# EAGLE design 16x2LCDShieldv2 (EAGLE 5.10)
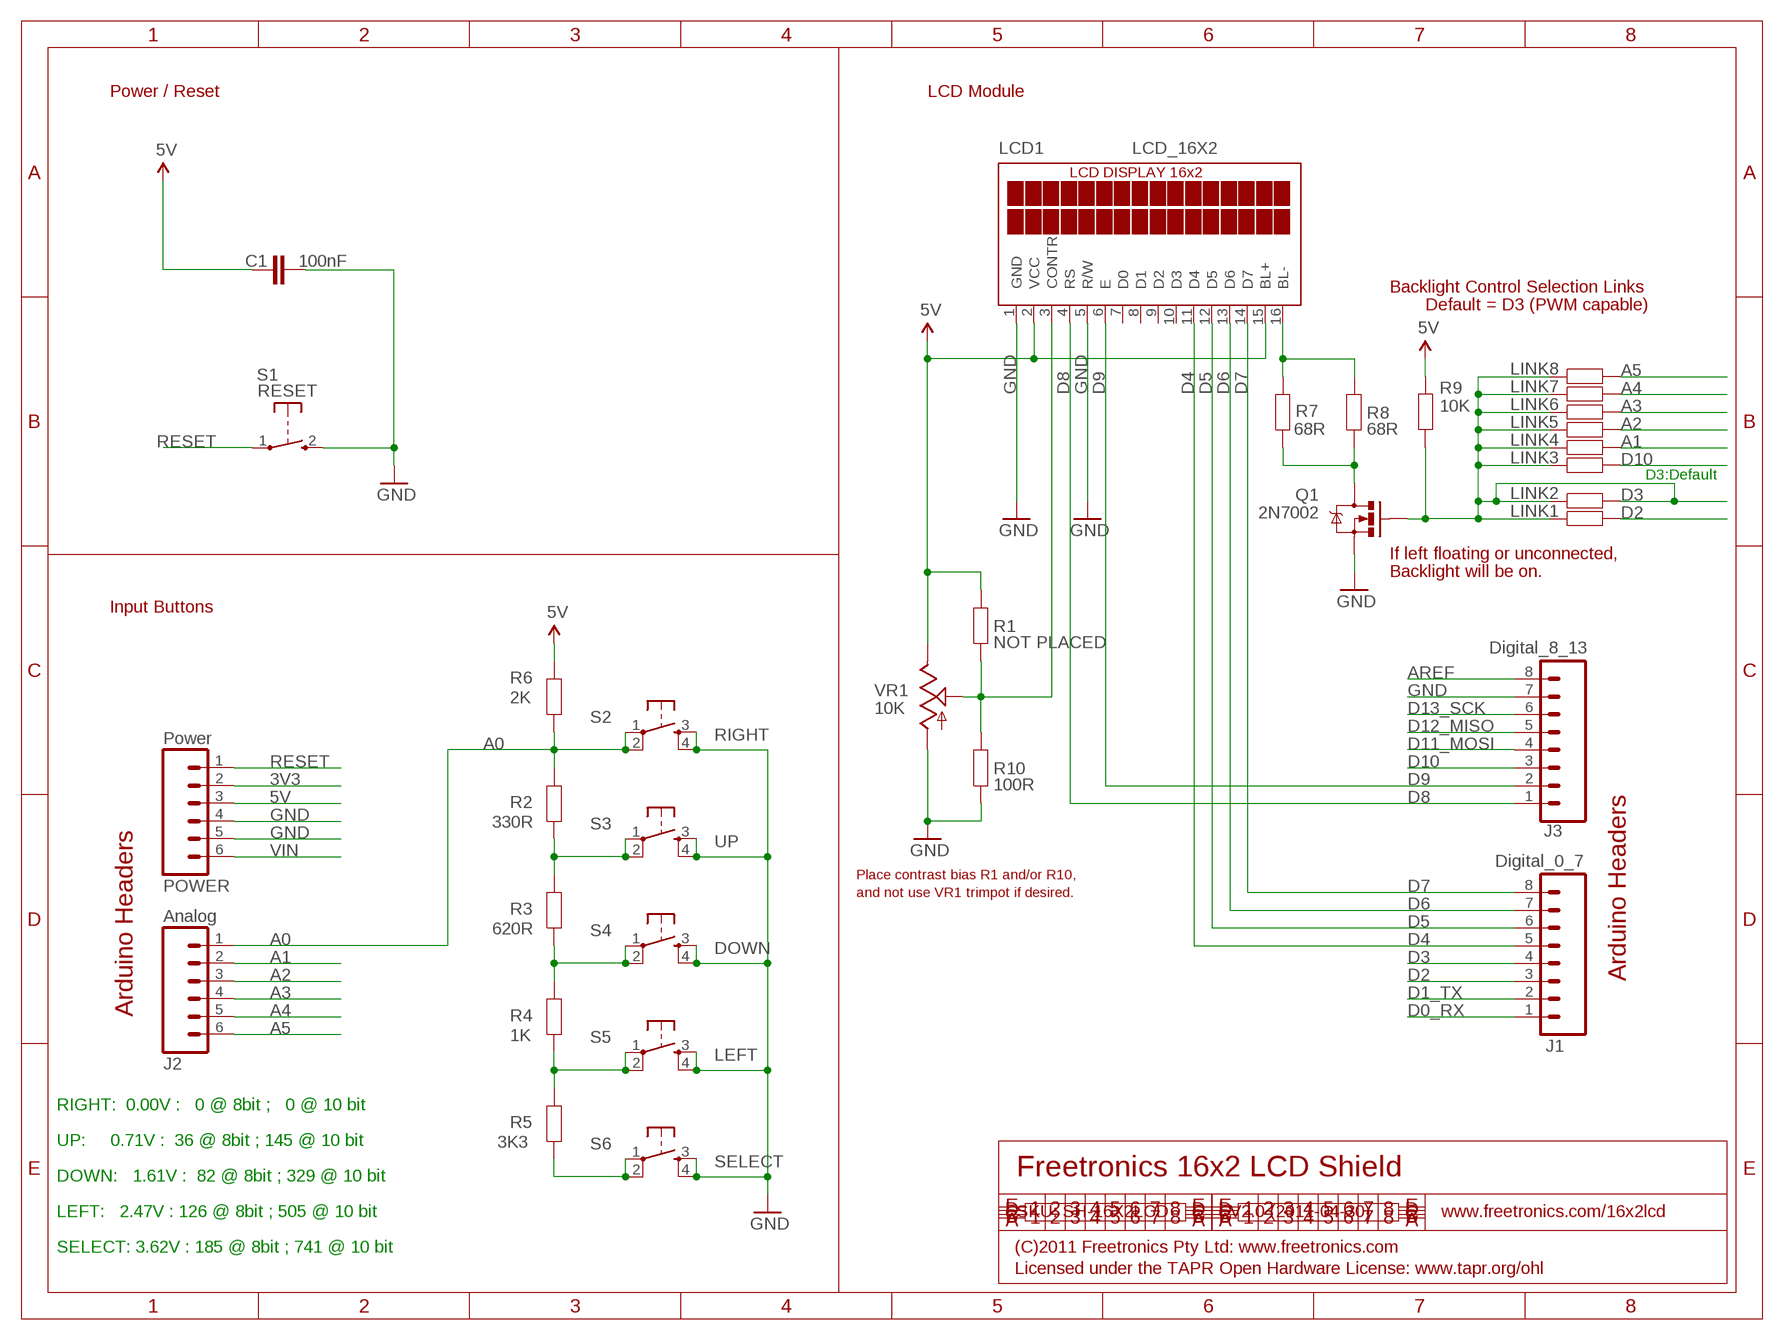
[diagram p0: schematic, sheet 1]

## Parts
C1  100nF  CAP0603  [0603]
J1  Digital_0_7  M08  [1X08]
J2  Analog  M06SIP  [1X06]
J3  Digital_8_13  M08  [1X08]
LCD1  LCD_16X2  LCD_16X2_NEWLCD_16X2  [LCD_16X2_REAR]
LINK1  RESISTOR0603  [0603]
LINK2  RESISTOR0603  [0603]
LINK3  RESISTOR0603  [0603]
LINK4  RESISTOR0603  [0603]
LINK5  RESISTOR0603  [0603]
LINK6  RESISTOR0603  [0603]
LINK7  RESISTOR0603  [0603]
LINK8  RESISTOR0603  [0603]
POWER  Power  M06SIP  [1X06]
Q1  2N7002  MOSFET-NCHANNELSMD  [SOT23-3]
R1  NOT PLACED  RESISTOR0603  [0603]
R2  330R  RESISTOR0603  [0603]
R3  620R  RESISTOR0603  [0603]
R4  1K  RESISTOR0603  [0603]
R5  3K3  RESISTOR0603  [0603]
R6  2K  RESISTOR0603  [0603]
R7  68R  RESISTOR0603  [0603]
R8  68R  RESISTOR0603  [0603]
R9  10K  RESISTOR0603  [0603]
R10  100R  RESISTOR0603  [0603]
S1  RESET  TAC_SWITCH_2PIN  [TACTILE_SWITCH_SMD_2PIN_TINY]
S2  RIGHT  TAC_SWITCHSMD  [TACTILE_SWITCH_SMD]
S3  UP  TAC_SWITCHSMD  [TACTILE_SWITCH_SMD]
S4  DOWN  TAC_SWITCHSMD  [TACTILE_SWITCH_SMD]
S5  LEFT  TAC_SWITCHSMD  [TACTILE_SWITCH_SMD]
S6  SELECT  TAC_SWITCHSMD  [TACTILE_SWITCH_SMD]
VR1  10K  POTTRIMPOT_SMT_BOURNS_3314J  [RTRIM3314J]

## Nets
3V3: POWER.2
5V: C1.1 LCD1.2(VCC) LCD1.15(BL+) POWER.3 R1.2 R6.2 R9.1 VR1.2(E)
A0: J2.1 R2.2 R6.1 S2.1 S2.2
A1: J2.2 LINK4.1
A2: J2.3 LINK5.1
A3: J2.4 LINK6.1
A4: J2.5 LINK7.1
A5: J2.6 LINK8.1
AREF: J3.8
D0_RX: J1.1
D1_TX: J1.2
D2: J1.3 LINK1.1
D3: J1.4 LINK1.2 LINK2.1 LINK2.2 LINK3.2 LINK4.2 LINK5.2 LINK6.2 LINK7.2 LINK8.2 Q1.1(G) R9.2
D4: J1.5 LCD1.11(D4)
D5: J1.6 LCD1.12(D5)
D6: J1.7 LCD1.13(D6)
D7: J1.8 LCD1.14(D7)
D8: J3.1 LCD1.4(RS)
D9: J3.2 LCD1.6(E)
D10: J3.3 LINK3.1
D11_MOSI: J3.4
D12_MISO: J3.5
D13_SCK: J3.6
GND: C1.2 J3.7 LCD1.1(GND) LCD1.5(R/W) POWER.4 POWER.5 Q1.2(S) R10.1 S1.2(S) S2.3 S2.4 S3.3 S3.4 S4.3 S4.4 S5.3 S5.4 S6.3 S6.4 VR1.1(A)
N$1: LCD1.3(CONTR) R1.1 R10.2 VR1.W(S)
N$2: R5.1 S6.1 S6.2
N$3: R4.1 R5.2 S5.1 S5.2
N$4: LCD1.16(BL-) R7.2 R8.2
N$5: Q1.3(D) R7.1 R8.1
N$248: R3.1 R4.2 S4.1 S4.2
N$250: R2.1 R3.2 S3.1 S3.2
RESET: POWER.1 S1.1(P)
VIN: POWER.6
Unconnected: LCD1.7(D0) LCD1.8(D1) LCD1.9(D2) LCD1.10(D3)

## Notes on the sheet
- Power / Reset | LCD Module
- Backlight Control Selection Links
- Default = D3 (PWM capable)
- D3:Default
- If left floating or unconnected,
- Backlight will be on.
- Input Buttons
- Place contrast bias R1 and/or R10,
- and not use VR1 trimpot if desired.
- Arduino Headers
- Arduino Headers
- RIGHT:  0.00V :   0 @ 8bit ;   0 @ 10 bit
- UP:     0.71V :  36 @ 8bit ; 145 @ 10 bit
- Freetronics 16x2 LCD Shield
- DOWN:   1.61V :  82 @ 8bit ; 329 @ 10 bit
- LEFT:   2.47V : 126 @ 8bit ; 505 @ 10 bit | SKU: SH-16X2LCD | V2.0 (2011-04-30) | www.freetronics.com/16x2lcd
- SELECT: 3.62V : 185 @ 8bit ; 741 @ 10 bit | (C)2011 Freetronics Pty Ltd: www.freetronics.com
- Licensed under the TAPR Open Hardware License: www.tapr.org/ohl

## Library data of the parts
C1 = freetronics-original:CAP: Capacitor Standard 0603 ceramic capacitor, and 0.1" leaded capacitor.
J1 J3 = freetronics:M08: Header 8 Standard 8-pin 0.1" header. Use with straight break away headers (SKU : PRT-00116), right angle break away headers (PRT-00553), swiss pins (PRT-00743), machine pins (PRT-00117), and female headers (PRT-00115).
J2 POWER = freetronics:M06: Header 6 Standard 6-pin 0.1" header. Use with straight break away headers (SKU : PRT-00116), right angle break away headers (PRT-00553), swiss pins (PRT-00743), machine pins (PRT-00117), and female headers (PRT-00115). Molex polarized connector foot print use with SKU : PRT-08094 with associated crimp pins and housings. NOTES ON THE VARIANTS LOCK and LOCK_LONGPADS... This footprint was designed to help hold the alignment of a through-hole component (i.e. 6-pin header) while soldering it into place. You may notice that each hole has been shifted either up or down by 0.005 of an inch from it's more standard position (which is a perfectly straight line). This slight alteration caused the pins (the squares in the middle) to touch the edges of the holes. Because they are alternating, it causes a "brace" to hold the component in place. 0.005 has proven to be the perfect amount of "off-center" position when using our standard breakaway headers. Although looks a little odd when you look at the bare footprint, once you have a header in there, the alteration is very hard to notice. Also, if you push a header all the way into place, it is covered up entirely on the bottom side. This idea of altering the position of holes to aid alignment will be further integrated into the Sparkfun Library for other footprints. It can help hold any component with 3 or more connection pins.
LCD1 = freetronics-master-v1:LCD_16X2_NEW: Tuxgraphics LCD display 16x2 characters reflective, without background light Source: tuxgr_12x2_r2.pdf
LINK1-LINK8 R1-R10 = freetronics-master-v1:RESISTOR: Resistor Basic schematic elements and footprints for 0603, 1206, and PTH 1/10th watt (small) resistors.
Q1 = freetronics-master-v1:MOSFET-NCHANNEL
S1 = freetronics-master-v1:TAC_SWITCH_2PIN: Momentary Tactile Switch - 2 pin
S2-S6 = freetronics-original:TAC_SWITCH: Momentary Switch Button commonly used for reset or general input. Spark Fun Electronics SKU : COM-00097
VR1 = freetronics-master-v1:POT

## Board
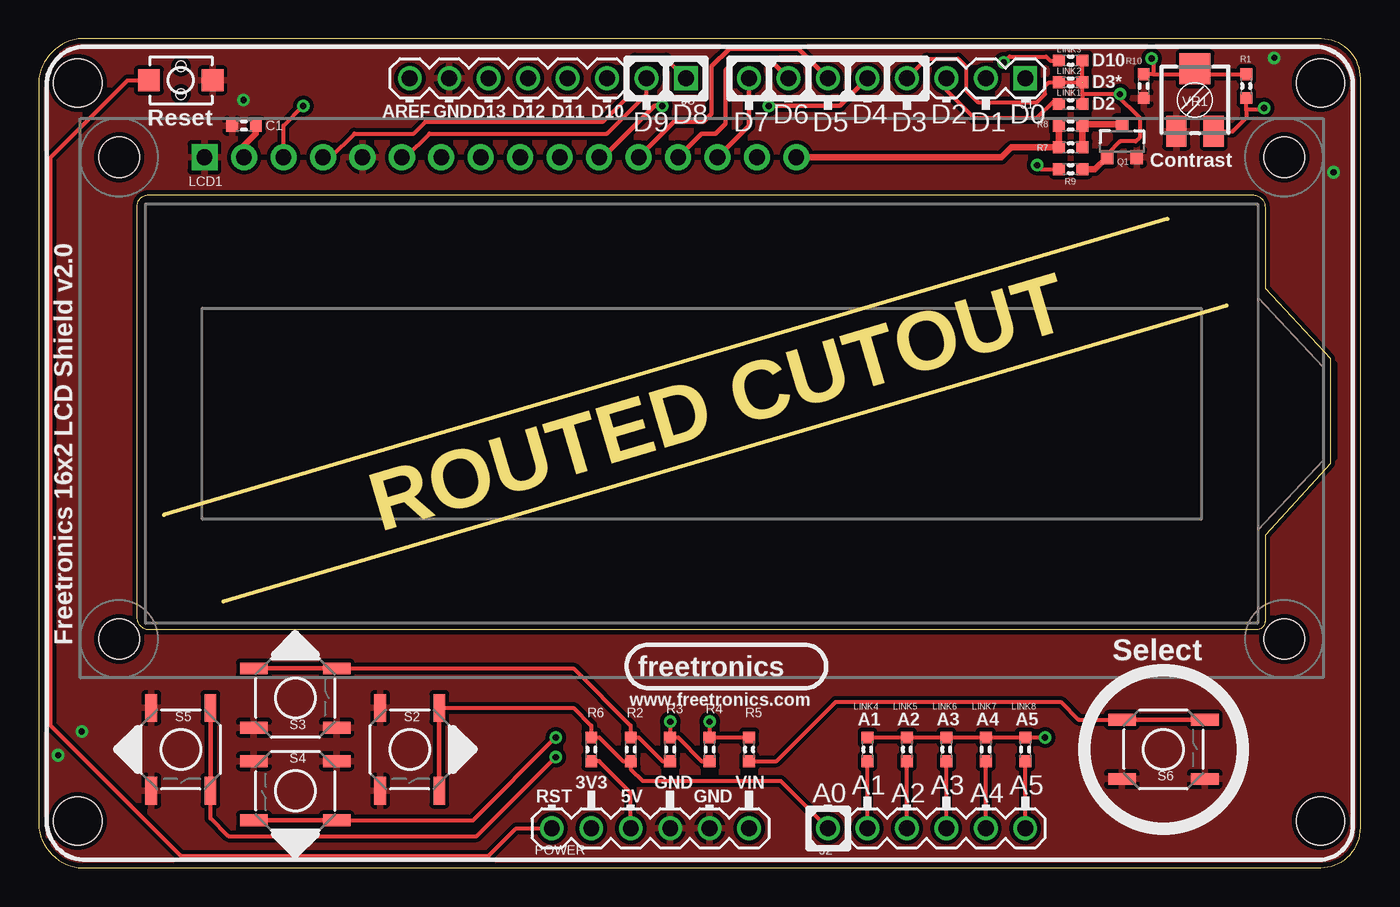
[diagram p1: board, top side]
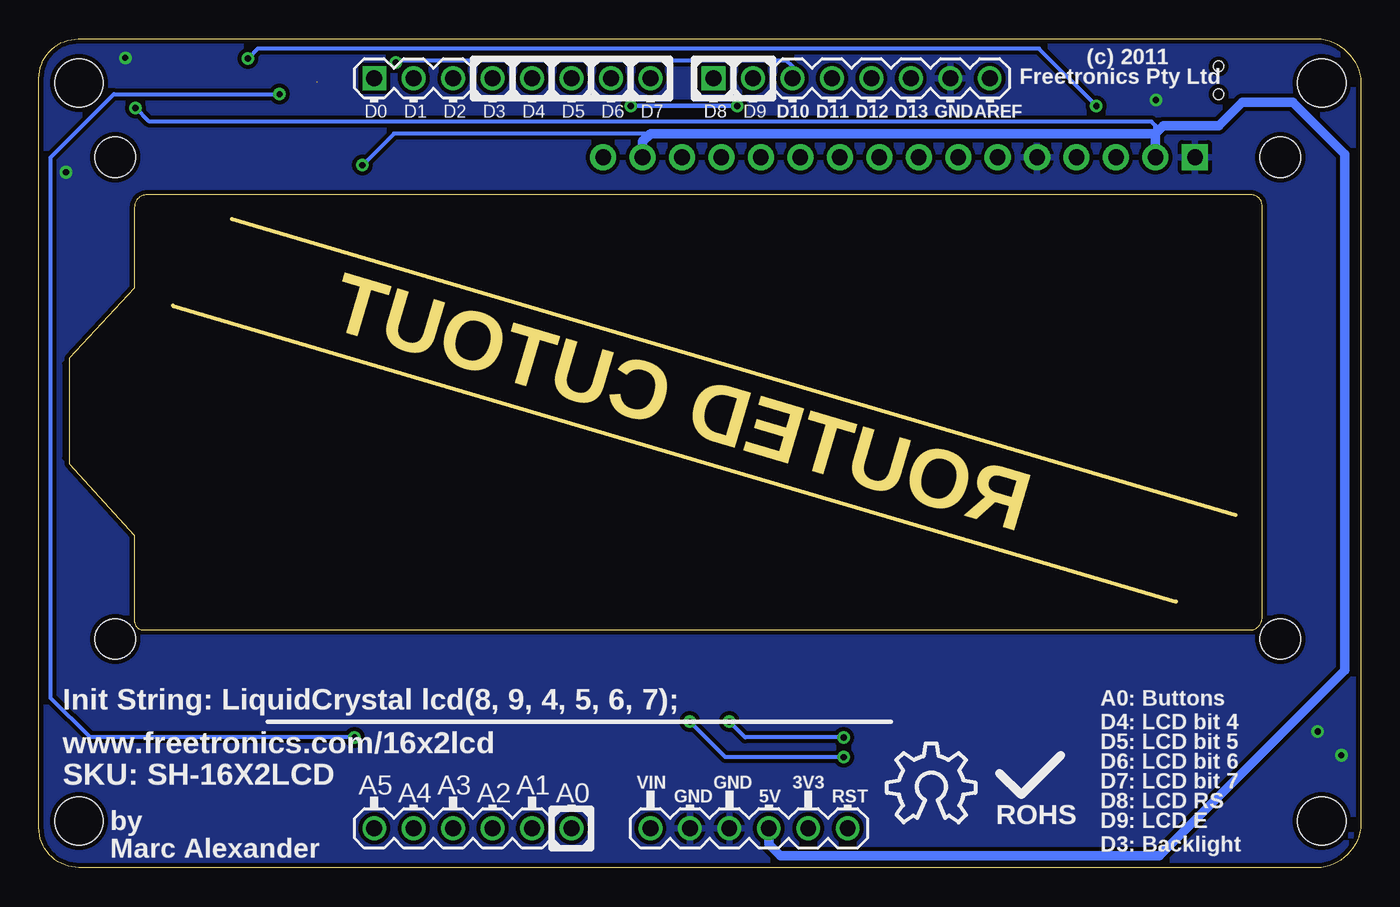
[diagram p2: board, bottom side, seen from below]

Size 85.09 x 53.34 mm. Coordinates in mm from the lower left corner, seen from the top.
Outline: 82.51,0 2.54,0 arc-74 0,2.54 0,50.8 arc-74 2.54,53.34 82.55,53.34 arc-90 85.09,50.8 85.09,2.58 arc-90 82.5,0.01
Outline: 72.66,41.76 8.06,22.71
Outline: 76.47,36.17 11.87,17.12
Outline: 7.04,43.3 78.14,43.3 arc-90 78.94,42.5 78.94,37.3 83.14,32.8 83.14,26 78.94,21.4 78.94,15.9 arc-90 78.34,15.3 7.14,15.3 arc-90 6.34,16.1 6.34,42.6 arc-90 7.04,43.3
Copper layers (1*16): Top 0.035mm / dielectric 1.5mm / Bottom 0.035mm
Design rules "default *": minimum track width 10mil, minimum drill 15mil, track to track 10mil, track to pad 10mil, pad to pad 10mil, via to via 10mil, smd to smd 8mil, copper to edge 12mil, drill to drill 8mil, minimum pad ring 10mil, minimum via ring 8mil, stop-mask expansion 4mil, vias tented up to drill 0mil, thermal gap 10mil
Holes 3.1 mm at 2.5,50.5 2.5,3 82.5,50.5 82.5,3
tRestrict: area 6.3,15.3 to 83.5,43.3
bRestrict: area 6.3,15.3 to 83.5,43.3

### Footprints (pad centres in the part's own frame; a part is rotated, then mirrored left to right if it is on the bottom)
0603 = smd 0.762 x 0.762: 1 -0.762,0; 2 0.762,0
1X08 = drill 1.016 square: 1 0,0 | drill 1.016 round: 2 2.54,0; 3 5.08,0; 4 7.62,0; 5 10.16,0; 6 12.7,0; 7 15.24,0; 8 17.78,0
1X06 = drill 1.016 round: 1 0,0; 2 2.54,0; 3 5.08,0; 4 7.62,0; 5 10.16,0; 6 12.7,0
LCD_16X2_REAR = drill 1 pad 1.676 square: 1 0,0 | drill 1 pad 1.676 round: 2 2.54,0; 3 5.08,0; 4 7.62,0; 5 10.16,0; 6 12.7,0; 7 15.24,0; 8 17.78,0; 9 20.32,0; 10 22.86,0; 11 25.4,0; 12 27.94,0; 13 30.48,0; 14 33.02,0; 15 35.56,0; 16 38.1,0 | hole 2.6: -5.5,-31; 69.5,-31; -5.5,0; 69.5,0
SOT23-3 = smd 0.8 x 0.9: 1 -0.95,-1; 2 0.95,-1; 3 0,1.1
TACTILE_SWITCH_SMD_2PIN_TINY = smd 1.4 x 1.4: 1 -2.05,0; 2 2.05,0 | hole 0.65: 0,0.9; 0,-0.9
TACTILE_SWITCH_SMD = smd 1.778 x 0.762: 1 -2.667,1.905; 2 2.667,1.905; 3 -2.667,-1.905; 4 2.667,-1.905
RTRIM3314J = smd 1.3 x 2: 1 -1.2,-2; 2 1.2,-2 | smd 2 x 2: W 0,2

### Placement (x,y rotation side)
C1  13.21,47.75 180 top
J1  63.5,50.8 180 top
J2  50.8,2.54 0 top
J3  41.66,50.8 180 top
LCD1  10.67,45.72 0 top
LINK1  66.42,49.15 0 top
LINK2  66.42,50.55 0 top
LINK3  66.42,51.94 0 top
LINK4  53.34,7.62 90 top
LINK5  55.88,7.62 90 top
LINK6  58.42,7.62 90 top
LINK7  60.96,7.62 90 top
LINK8  63.5,7.62 90 top
POWER  33.02,2.54 0 top
Q1  69.72,46.74 0 top
R1  77.72,50.29 270 top
R2  38.1,7.62 270 top
R3  40.64,7.62 270 top
R4  43.18,7.62 270 top
R5  45.72,7.62 90 top
R6  35.56,7.62 270 top
R7  66.42,46.35 180 top
R8  66.42,47.75 180 top
R9  66.42,44.96 0 top
R10  71.12,50.29 90 top
S1  9.14,50.67 0 top
S2  23.88,7.62 270 top
S3  16.51,10.92 0 top
S4  16.51,4.95 180 top
S5  9.14,7.62 270 top
S6  72.39,7.62 0 top
U$5  [OSHW_10X200_NOTEXT]  30.48,2.92 0 bottom
VR1  74.42,49.4 0 top

### Tracks (layer width: path | path; a pad name or v marks a point on that pad's centre or on a via)
5V  (via drill 0.4)
  Top 0.254: 77.72,48.77 R1.2 | POWER.3 38.1,4.83 36.07,6.86 R6.2 | v78.87,48.9 78.74,48.77 77.72,48.77 | R9.1 64.52,44.96 v64.26,45.21 | VR1.2 75.65,47.37 76.83,47.37 77.72,48.26 77.72,48.77
  Top 0.406: C1.1 13.97,47.24 13.21,46.48 LCD1.2
  Bottom 0.254: v78.87,48.9 77.98,48.01 13.46,48.01 13.21,47.75 13.21,47.24 | v64.26,45.21 62.23,47.24 45.72,47.24
  Bottom 0.61: POWER.3 38.1,1.52 37.34,0.76 12.95,0.76 1.02,12.7 1.02,45.92 4.37,49.28 7.62,49.28 9.14,47.75 12.7,47.75 13.21,47.24 | 13.21,47.24 LCD1.2 | LCD1.15 46.23,46.74 45.72,47.24 13.21,47.24
A0
  Top 0.254: J2.1 47.75,5.59 38.86,5.59 38.1,6.35 R2.2 37.59,6.86 36.07,8.38 R6.1 35.56,9.14 34.42,10.29 S2.1
  Top 0.305: S2.2 S2.1
A1
  Top 0.254: J2.2 LINK4.1
A2
  Top 0.254: J2.3 LINK5.1
A3
  Top 0.254: J2.4 LINK6.1
A4
  Top 0.254: J2.5 LINK7.1
A5
  Top 0.254: J2.6 LINK8.1
D2
  Top 0.254: LINK1.1 65.41,49.4 64.26,48.26 60.2,48.26 58.42,50.04 J1.3
D3  (via drill 0.4)  (1 unrouted)
  Top 0.254: J1.4 57.15,52.07 59.18,52.07 59.69,51.56 59.69,50.04 60.45,49.28 64.26,49.28 64.77,49.78 64.77,50.29 65.02,50.55 LINK2.1 67.21,50.55 | LINK3.2 LINK2.2 67.18,49.78 | 67.18,49.78 LINK1.2 | Q1.1 68.77,45.91 69.6,46.74 70.61,46.74 70.87,46.99 70.87,48.26 69.34,49.78 | 69.34,49.78 67.18,49.78 | LINK4.2 LINK5.2 LINK6.2 LINK7.2 LINK8.2 v64.77,8.38 | v69.6,49.78 69.34,49.78
  Top 0.406: R9.2 68,44.96 Q1.1
  Bottom 0.254: v64.77,8.38 81.79,8.38 84.33,10.92 84.33,45.72 80.26,49.78 v69.6,49.78
D4  (via drill 0.4)
  Top 0.305: LCD1.11 36.32,45.72 39.62,49.02 v40.13,49.02 | v46.99,49.02 51.56,49.02 J1.5
  Bottom 0.305: v40.13,49.02 v46.99,49.02
D5
  Top 0.305: J1.6 48.9,52.7 44.45,52.7 43.31,51.56 43.31,48.51 42.8,48.01 40.89,48.01 LCD1.12
D6
  Top 0.305: J1.7 46.99,52.07 44.96,52.07 44.2,51.31 44.2,47.88 43.56,47.24 42.67,47.24 LCD1.13
D7
  Top 0.305: LCD1.14 45.72,47.75 J1.8
D8
  Top 0.254: J3.1 40.39,52.07 38.35,52.07 37.85,51.56 37.85,49.53 36.32,48.01 24.89,48.01 24.13,47.24 20.32,47.24 18.8,45.72 LCD1.4
D9
  Top 0.254: LCD1.6 23.62,45.72 25.15,47.24 36.58,47.24 39.12,49.78 J3.2
D10  (via drill 0.4)
  Top 0.254: LINK3.1 65.1,51.94 64.85,52.2 62.48,52.2 v62.1,51.82
  Bottom 0.254: v62.1,51.82 61.98,51.94 36.96,51.94 36.58,51.56 J3.3
GND  (via drill 0.4)
  other vias: 83.34,44.75 79.53,52.12 13.18,49.4 1.24,7.24 2.77,8.76
  pour Bottom: 0,50.8 arc-74 2.54,53.34 82.55,53.34 arc-74 85.09,50.8 85.09,5.08 85.18,2.54 arc-74 82.61,0 2.54,0 arc-74 0,2.54
  pour Top: 0,50.8 arc-74 2.54,53.34 82.55,53.34 arc-74 85.09,50.8 85.09,5.08 85.15,2.54 arc-74 82.61,0 2.54,0 arc-74 0,2.54
N$1  (via drill 0.4)
  Top 0.254: LCD1.3 15.75,47.75 v17.02,49.02 | v71.63,52.07 71.75,51.94 71.75,51.05 | 71.75,51.05 74.33,51.05 VR1.W 74.52,51.05 R1.1 | 71.75,51.05 R10.2
  Bottom 0.254: v17.02,49.02 20.7,52.7 70.99,52.7 v71.63,52.07
N$2
  Top 0.254: R5.1 47.5,6.86 51.31,10.67 65.79,10.67 66.93,9.53 S6.1
  Top 0.305: S6.1 S6.2
N$3  (via drill 0.4)
  Top 0.254: R5.2 R4.1 v43.18,9.4 | S5.2 11.05,3.17 12.19,2.03 28.19,2.03 v33.27,7.11
  Top 0.305: S5.2 S5.1
  Bottom 0.254: v33.27,7.11 40.89,7.11 v43.18,9.4
N$4
  Top 0.406: LCD1.16 61.98,45.72 62.61,46.35 R7.2 R8.2
N$5
  Top 0.406: R7.1 R8.1 67.27,47.84 Q1.3
N$248  (via drill 0.4)
  Top 0.254: R4.2 42.67,6.86 41.15,8.38 R3.1 v40.64,9.4 | S4.1 27.94,3.05 v33.27,8.38
  Top 0.305: S4.2 S4.1
  Bottom 0.254: v33.27,8.38 39.62,8.38 v40.64,9.4
N$250
  Top 0.254: R3.2 40.13,6.86 38.61,8.38 R2.1 38.1,9.14 34.42,12.83 S3.2
  Top 0.305: S3.1 S3.2
RESET
  Top 0.254: POWER.1 30.73,2.54 28.96,0.76 9.14,0.76 0.76,9.14 0.76,45.72 5.71,50.67 S1.1

### Text on the board
Dimension: ROUTED CUTOUT
tPlace: D10 | D3* | D2 | Reset | AREF | GND | D13 | D12 | D11 | D10 | D8 | D6 | D4 | D2 | D0 | D9 | D7 | D5 | D3 | D1 | Contrast | Freetronics 16x2 LCD Shield v2.0 | Select | freetronics | www.freetronics.com | A1 | A2 | A3 | A4 | A5 | 3V3 | GND | VIN | A1 | A3 | A5 | RST | 5V | GND | A0 | A2 | A4
bPlace: (c) 2011 | Freetronics Pty Ltd | AREF | GND | D13 | D12 | D11 | D10 | D9 | D8 | D7 | D6 | D5 | D4 | D3 | D2 | D1 | D0 | A0: Buttons | Init String: LiquidCrystal lcd(8, 9, 4, 5, 6, 7); | D4: LCD bit 4 | D5: LCD bit 5 | www.freetronics.com/16x2lcd | D6: LCD bit 6 | D7: LCD bit 7 | 3V3 | GND | VIN | A1 | A3 | A5 | SKU: SH-16X2LCD | D8: LCD RS | RST | 5V | GND | A0 | A2 | A4 | D9: LCD E | ROHS | by | D3: Backlight | Marc Alexander
Holes: ROUTED CUTOUT